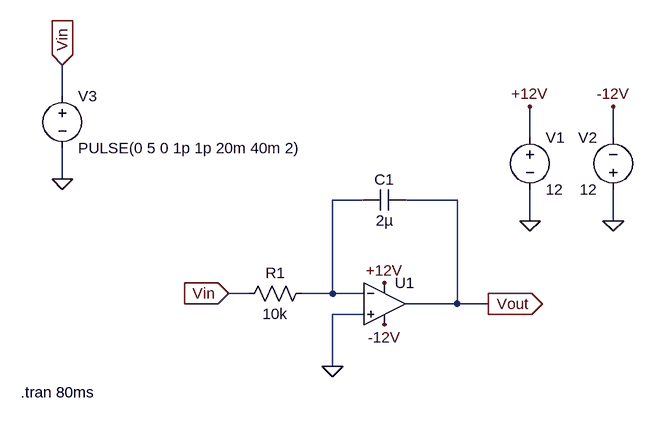
[diagram p0: schematic Draft2.asc]
Draft2.asc, the LTspice schematic file:
Version 4
SHEET 1 880 680
WIRE -288 -176 -288 -224
WIRE 432 -112 432 -160
WIRE 560 -112 560 -160
WIRE -288 -48 -288 -96
WIRE 176 -16 128 -16
WIRE 320 -16 240 -16
WIRE 432 16 432 -32
WIRE 560 16 560 -32
WIRE 0 128 -32 128
WIRE 128 128 128 -16
WIRE 128 128 80 128
WIRE 176 128 128 128
WIRE 320 144 320 -16
WIRE 320 144 240 144
WIRE 368 144 320 144
WIRE 176 160 128 160
WIRE 128 240 128 160
FLAG 128 240 0
FLAG 432 16 0
FLAG 560 16 0
FLAG 368 144 Vout
IOPIN 368 144 Out
FLAG -288 -48 0
FLAG -288 -224 Vin
IOPIN -288 -224 In
FLAG -32 128 Vin
IOPIN -32 128 In
FLAG 432 -160 +12V
FLAG 208 112 +12V
FLAG 560 -160 -12V
FLAG 208 176 -12V
SYMBOL OpAmps\\UniversalOpAmp2 208 144 R0
SYMATTR InstName U1
SYMATTR Value2 Avol=1Meg GBW=10G Slew=10G
SYMBOL cap 240 -32 R90
WINDOW 0 0 32 VBottom 2
WINDOW 3 32 32 VTop 2
SYMATTR InstName C1
SYMATTR Value 2µ
SYMBOL res 96 112 R90
WINDOW 0 0 56 VBottom 2
WINDOW 3 32 56 VTop 2
SYMATTR InstName R1
SYMATTR Value 10k
SYMBOL voltage 432 -128 R0
WINDOW 123 0 0 Left 0
WINDOW 39 0 0 Left 0
SYMATTR InstName V1
SYMATTR Value 12
SYMBOL voltage 560 -16 R180
WINDOW 0 24 96 Left 2
WINDOW 3 24 16 Left 2
WINDOW 123 0 0 Left 0
WINDOW 39 0 0 Left 0
SYMATTR InstName V2
SYMATTR Value 12
SYMBOL voltage -288 -192 R0
WINDOW 123 0 0 Left 0
WINDOW 39 0 0 Left 0
SYMATTR InstName V3
SYMATTR Value PULSE(0 5 0 1p 1p 20m 40m 2)
TEXT -352 280 Left 2 !.tran 80ms

The netlist it stands for:
* Draft2.asc
XU1 0 N001 +12V -12V Vout level2 Avol=1Meg GBW=10G Slew=10G Ilimit=25m Rail=0 Vos=0 En=0 Enk=0 In=0 Ink=0 Rin=500Meg  ; pins In+ In- V+ V- OUT
C1 Vout N001 2µ
R1 N001 Vin 10k
V1 +12V 0 12
V2 0 -12V 12
V3 Vin 0 PULSE(0 5 0 1p 1p 20m 40m 2)
.tran 80ms
.lib UniversalOpAmp2.lib
.backanno
.end